# Altium project PCB_Project_1.PrjPcb
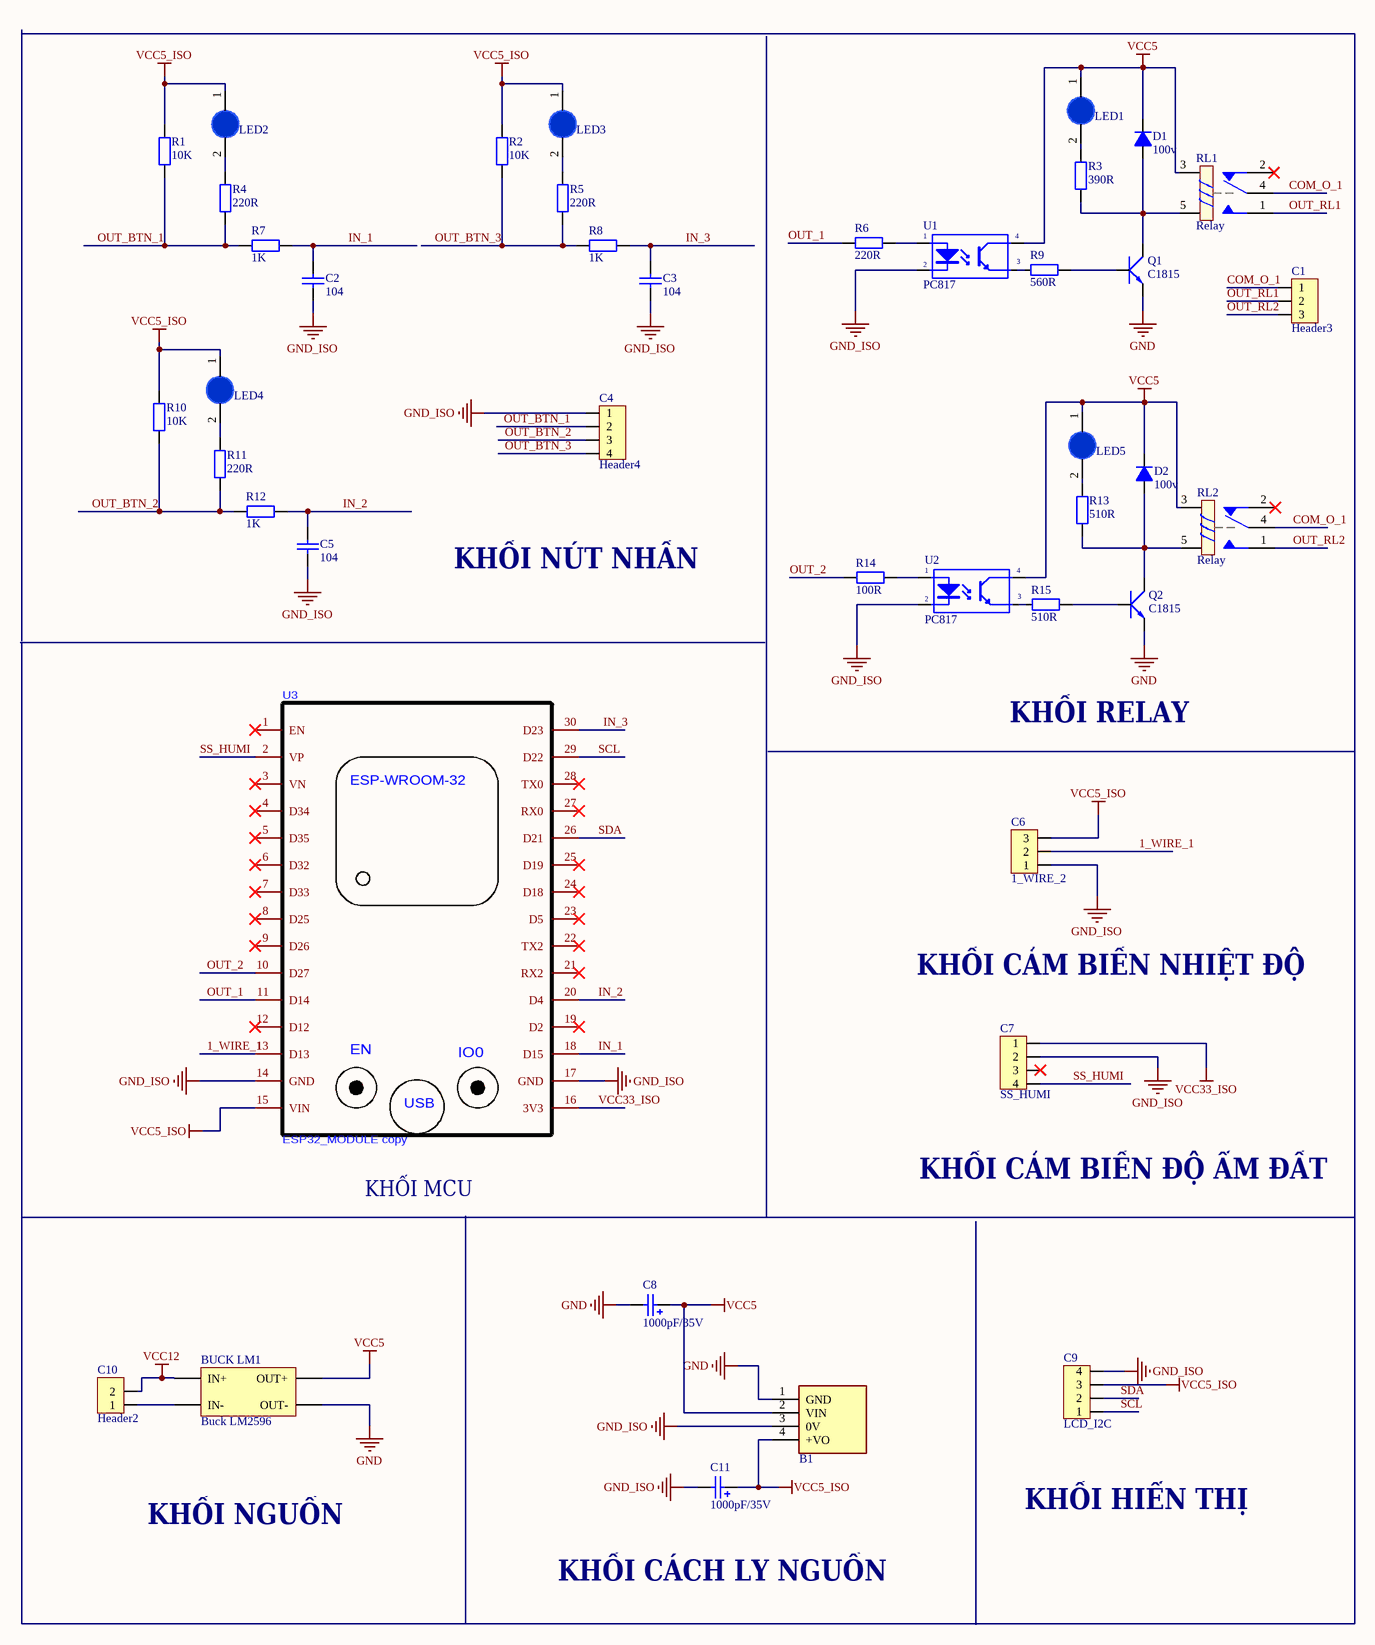
[diagram p0: Sheet1.SchDoc]
1 sheet, 42 parts. Net scope: global (net labels, ports and power ports of the same name join across sheets).
Board file: PCB1.PcbDoc

## Sheet Sheet1.SchDoc
size A2; SheetNumber: 1; SheetTotal: 1

### Parts
B1  B0505S1W  [B0505S1W]  (value not drawn)
BUCK_LM1  Buck LM2596  [BUCK LM2596]
C1  Header3  [Header3]
C2  104  [tu gom]
C3  104  [tu gom]
C4  Header4  [Header4]
C5  104  [tu gom]
C6  1_WIRE_2  [Header3]
C7  SS_HUMI  [Header4]
C8  value 1000pF/35V  [CP2/5]  (hidden comment: Cap Pol3)
C9  LCD_I2C  [Header4]
C10  Header2  [Header2]
C11  value 1000pF/35V  [CP2/5]  (hidden comment: Cap Pol3)
D1  100v  [DIODE 0.5A]
D2  100v  [DIODE 0.5A]
LED1  LED 3mm  [LED-3MM-BLUE]  (value not drawn)
LED2  LED 3mm  [LED-3MM-BLUE]  (value not drawn)
LED3  LED 3mm  [LED-3MM-BLUE]  (value not drawn)
LED4  LED 3mm  [LED-3MM-BLUE]  (value not drawn)
LED5  LED 3mm  [LED-3MM-BLUE]  (value not drawn)
Q1  C1815  [C1815_cam]
Q2  C1815  [C1815_cam]
R1  10K  [R1/4W]
R2  10K  [R1/4W]
R3  390R  [R1/4W]
R4  220R  [R1/4W]
R5  220R  [R1/4W]
R6  220R  [R1/4W]
R7  1K  [R1/4W]
R8  1K  [R1/4W]
R9  560R  [R1/4W]
R10  10K  [R1/4W]
R11  220R  [R1/4W]
R12  1K  [R1/4W]
R13  510R  [R1/4W]
R14  100R  [R1/4W]
R15  510R  [R1/4W]
RL1  Relay  [RELAY_SRA_05VDC_SL_C]
RL2  Relay  [RELAY_SRA_05VDC_SL_C]
U1  PC817  [DIP4/W0.3]
U2  PC817  [DIP4/W0.3]
U3  ESP32_MODULE copy  [ESP32-WIFIMODULE-FOOTPRINT]

### Nets
GND: B1.1(GND) BUCK_LM1.3(OUT-) C8.2 Q1.1(E) Q2.1(E)
GND_ISO: B1.3(0V) C2.2 C3.2 C4.1 C5.2 C6.1 C7.2 C9.4 C11.2 U1.2(K) U2.2(K) U3.14(GND) U3.17(GND)
VCC5: B1.2(VIN) BUCK_LM1.4(OUT+) C8.1 D1.2(K) D2.2(K) LED1.1(A) LED5.1(A) RL1.3 RL2.3 U1.4(C) U2.4(C)
VCC5_ISO: B1.4(+VO) C6.3 C9.3 C11.1 LED2.1(A) LED3.1(A) LED4.1(A) R1.2 R2.2 R10.2 U3.15(VIN)
VCC12: BUCK_LM1.1(IN+) C10.2
VCC33_ISO: C7.1 U3.16(3V3)
1_WIRE_1: C6.2 U3.13(D13)
COM_O_1: C1.1 RL1.4 RL2.4
IN_1: C2.1 R7.1 U3.18(D15)
IN_2: C5.1 R12.1 U3.20(D4)
IN_3: C3.1 R8.1 U3.30(D23)
OUT_1: R6.1 U3.11(D14)
OUT_2: R14.1 U3.10(D27)
OUT_BTN_1: C4.2 R1.1 R4.1 R7.2
OUT_BTN_2: C4.3 R10.1 R11.1 R12.2
OUT_BTN_3: C4.4 R2.1 R5.1 R8.2
OUT_RL1: C1.2 RL1.1
OUT_RL2: C1.3 RL2.1
SCL: C9.1 U3.29(D22)
SDA: C9.2 U3.26(D21)
SS_HUMI: C7.4 U3.2(VP)
NetBUCK_LM1_2: BUCK_LM1.2(IN-) C10.1
NetD1_1: D1.1(A) Q1.2(C) R3.2 RL1.5
NetD2_1: D2.1(A) Q2.2(C) R13.2 RL2.5
NetLED1_2: LED1.2(K) R3.1
NetLED2_2: LED2.2(K) R4.2
NetLED3_2: LED3.2(K) R5.2
NetLED4_2: LED4.2(K) R11.2
NetLED5_2: LED5.2(K) R13.1
NetQ1_3: Q1.3(B) R9.2
NetQ2_3: Q2.3(B) R15.2
NetR6_2: R6.2 U1.1(A)
NetR9_1: R9.1 U1.3(E)
NetR14_2: R14.2 U2.1(A)
NetR15_1: R15.1 U2.3(E)

Not connected (* = marked no-connect by the designer): C7 3*; RL1 2*; RL2 2*; U3 1(EN)* 3(VN)* 4(D34)* 5(D35)* 6(D32)* 7(D33)* 8(D25)* 9(D26)* 12(D12)* 19(D2)* 21(RX2)* 22(TX2)* 23(D5)* 24(D18)* 25(D19)* 27(RX0)* 28(TX0)*

### Notes on the sheet
- KHỐI NÚT NHẤN
- KHỐI RELAY
- KHỐI CẢM BIẾN NHIỆT ĐỘ
- KHỐI CẢM BIẾN ĐỘ ẨM ĐẤT
- KHỐI MCU
- KHỐI HIỂN THỊ
- KHỐI NGUỒN
- KHỐI CÁCH LY NGUỒN
- (in symbol ESP32_MODULE copy) ESP-WROOM-32; IO0; USB

### Library data of the parts
B1 = B0505S1W: Power Supply; Manufacturer_Name: Mornsun; Manufacturer_Part_Number: B0505S-1W; Datasheet Link: https://www.mornsun-power.com/uploads/pdf/B_D-1W.pdf; Height: 10.41mm
C1 C6 = Header3: Header IDC, 3 x 1 Pin Vertical 2.54mm Pitch (Non-Boxed, Male); Manufacturer: W¨¹rth Elektronik eiSos GmbH; partNo: 613002143121; ComponentLink1 Description: Manufacturer; ComponentLink2 Description: Datasheet; NoPins: 02; Created Date: 29 March 2013; ComponentLink1URL: http://www.we-online.com; ComponentLink2URL: http://katalog.we-online.de/em/datasheet/6130xx143121.pdf; Created by: Karrer Zheng
C2 C3 C5 = Tu gom 104 50V: Cắm; So_Chan: 2; Ten_Linh_Kien: Tụ gốm 104 100nF 50V; Don_Vi: Con; Ma_Hang: MH004761; Chung_Loai: Cắm; Kieu_Chan: *
C4 C7 C9 = Header4: Header IDC, 4 x 1 Pin Vertical 2.54mm Pitch (Non-Boxed, Male); Manufacturer: W¨¹rth Elektronik eiSos GmbH; partNo: 613002143121; ComponentLink1 Description: Manufacturer; ComponentLink2 Description: Datasheet; NoPins: 02; Created Date: 29 March 2013; ComponentLink1URL: http://www.we-online.com; ComponentLink2URL: http://katalog.we-online.de/em/datasheet/6130xx143121.pdf; Created by: Karrer Zheng
C8 C11 = Cap Pol3: Polarized Capacitor (Surface Mount); VALUE: C?; LatestRevisionDate: 17-Jul-2002; LatestRevisionNote: Re-released for DXP Platform.; PackageReference: C0805; Publisher: Altium Limited
C10 = Header2: Header IDC, 2 x 1 Pin Vertical 2.54mm Pitch (Non-Boxed, Male); Manufacturer: W¨¹rth Elektronik eiSos GmbH; partNo: 613002143121; ComponentLink1 Description: Manufacturer; ComponentLink2 Description: Datasheet; NoPins: 02; Created Date: 29 March 2013; ComponentLink1URL: http://www.we-online.com; ComponentLink2URL: http://katalog.we-online.de/em/datasheet/6130xx143121.pdf; Created by: Karrer Zheng
D1 D2 = Diode 1N4148: Cắm; Ten_Linh_Kien: Diode 1N4148 DO35 450mA 100V ( 1N4148 DIP); Don_Vi: Con; Ma_Hang: MH001065; Ghi Chu: *; Kieu_Chan: *; Chung_Loai: Cắm
LED1-LED5 = LED 3mm Xanh Duong: Cắm; Don_Vi: Con; Ma_Hang: MH009003; Ten_Linh_Kien: LED 3MM Xanh Dương SS (1000c); Ghi_Chu: *; Kieu_Chan: *; Chung_Loai: Cắm
Q1 Q2 = C1815: NPN 600mW, ECB; Value: C1815
R1-R15 = R1/4W: Resistor 1/4W; Value: R1/4W - 1K
RL1 RL2 = RL_SRA-05VDC-SL-C: Relay 5 Chan; Ma_Hang: MH009374; Ten: Relay 5V10A SRD-05VDC-SL-C Chính Hãng
U1 U2 = PC817: Single Opto; Value: PC817